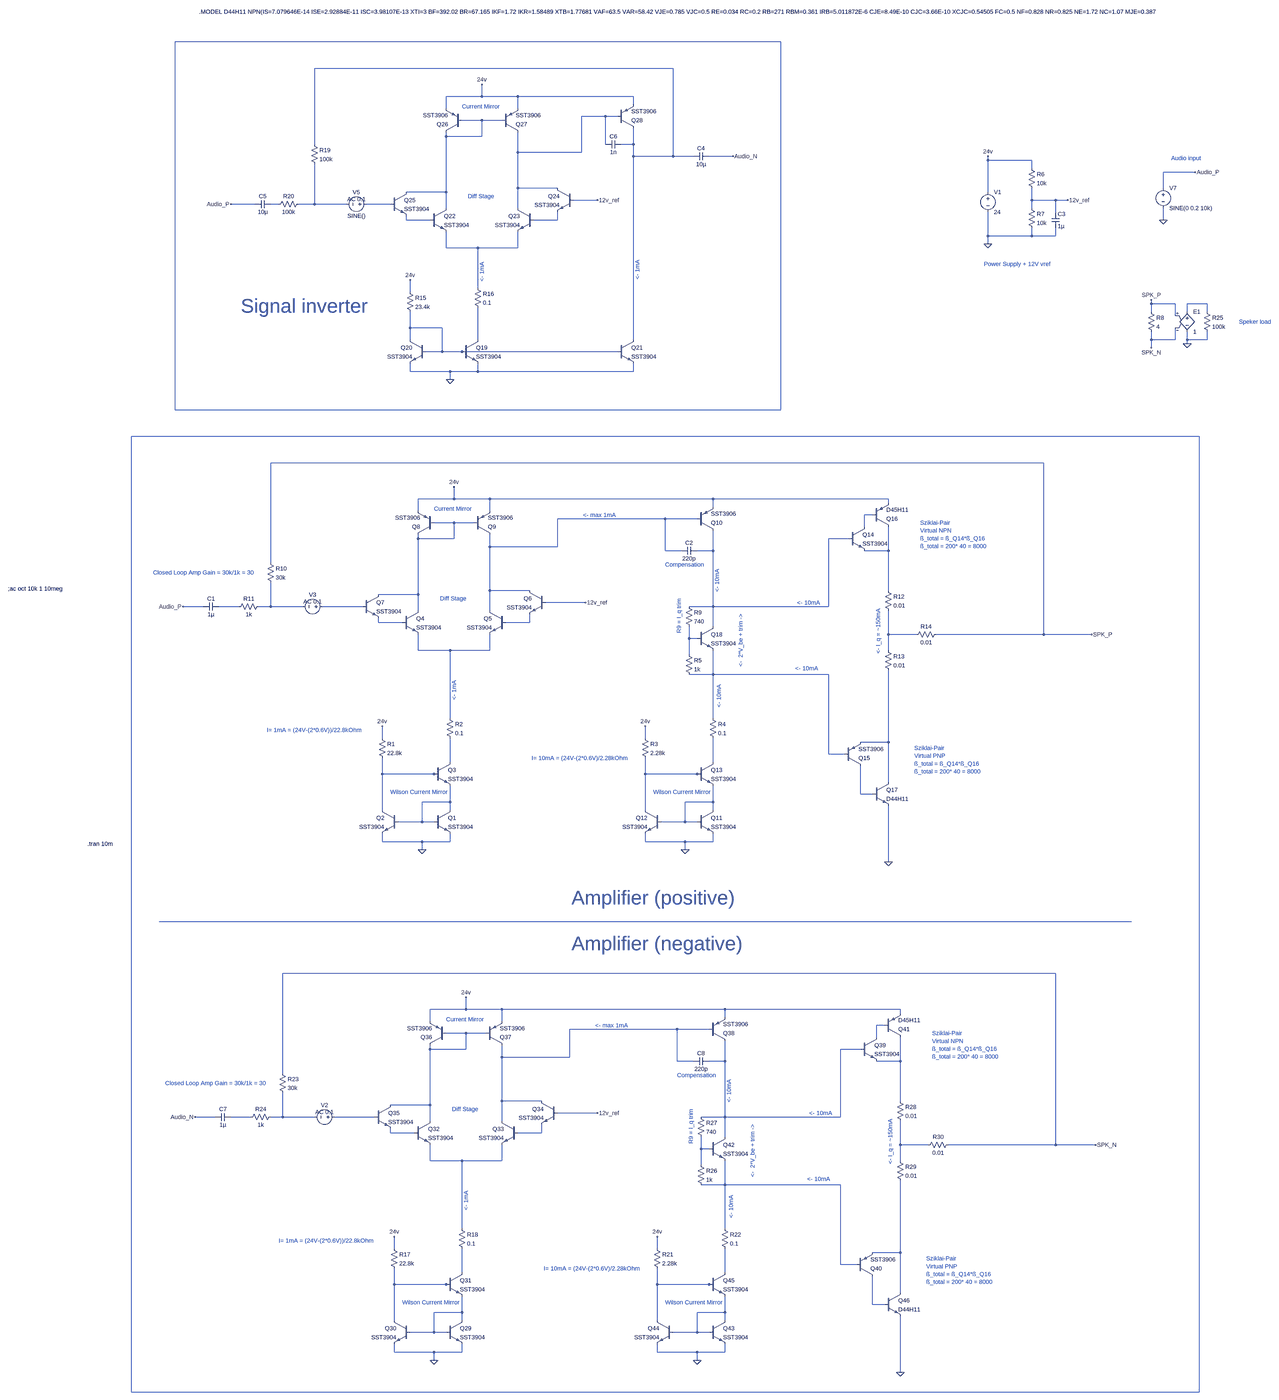
[diagram p0: schematic ClassAB.asc, whole sheet]
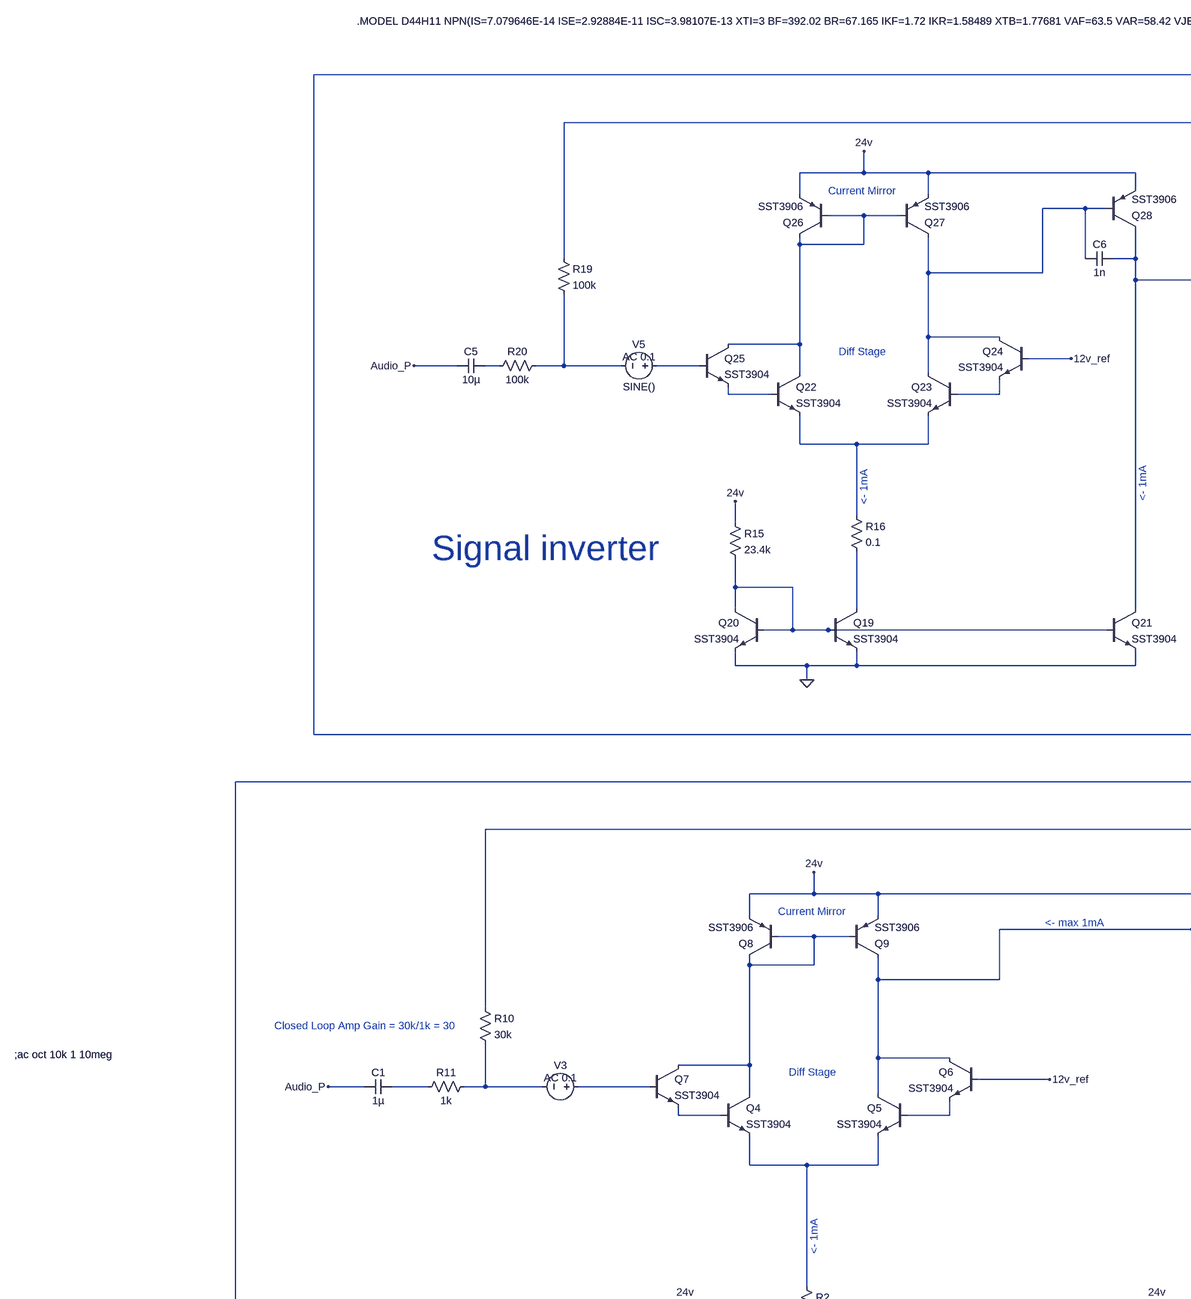
[diagram p1: schematic ClassAB.asc, part, row 1 of 2, column 1 of 2]
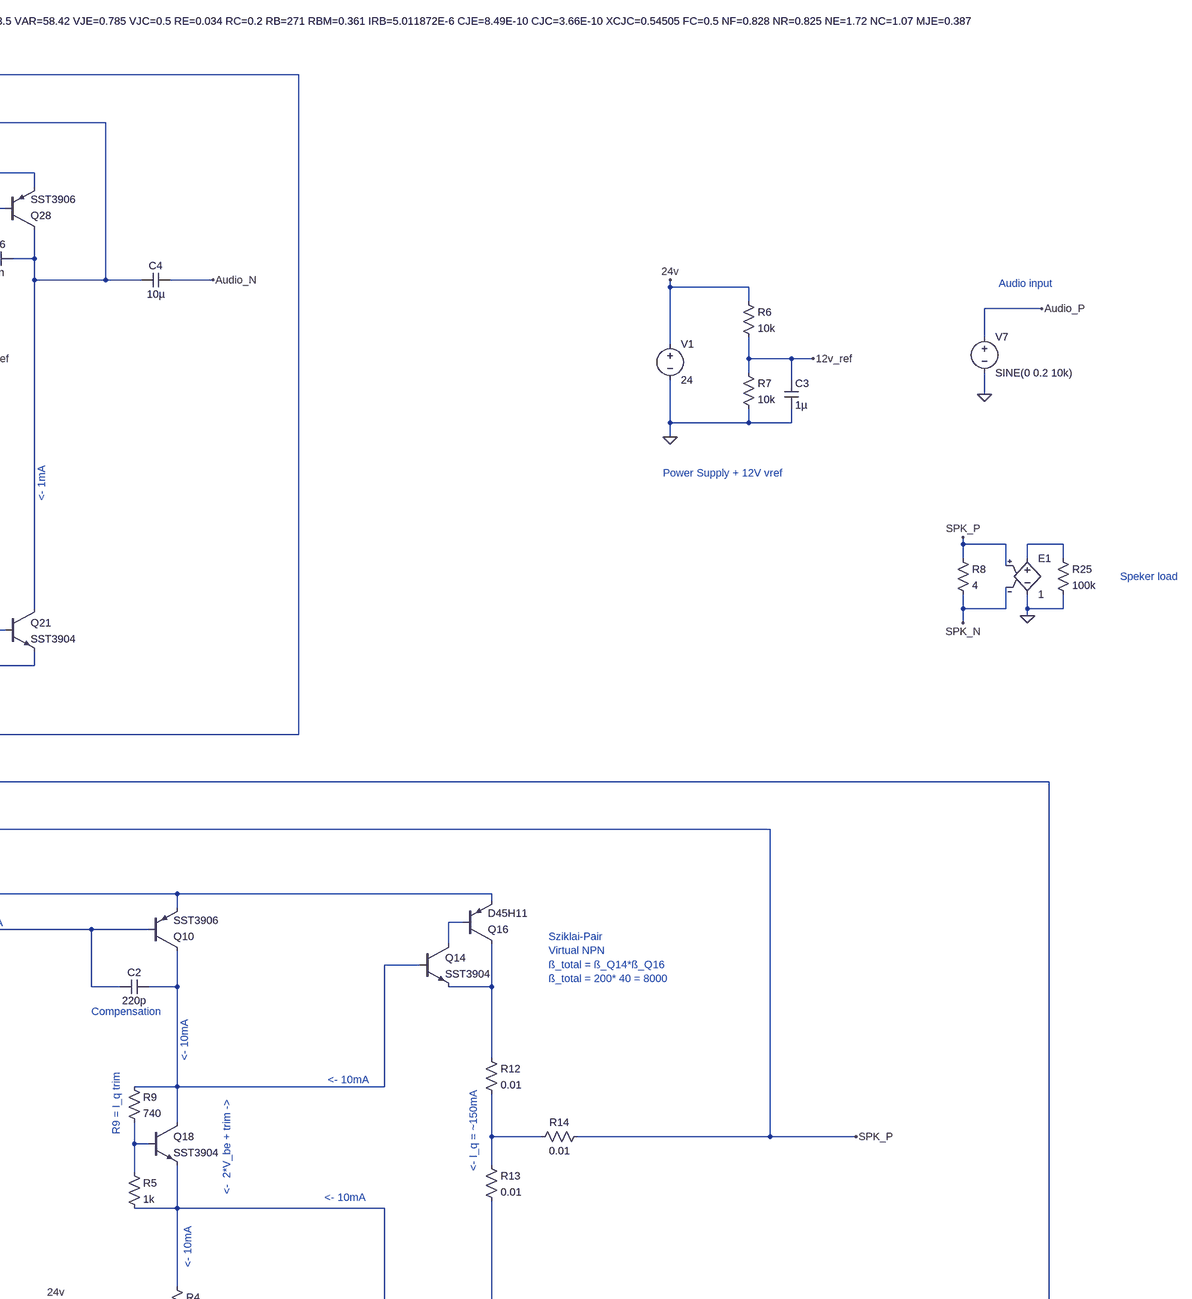
[diagram p2: schematic ClassAB.asc, part, row 1 of 2, column 2 of 2]
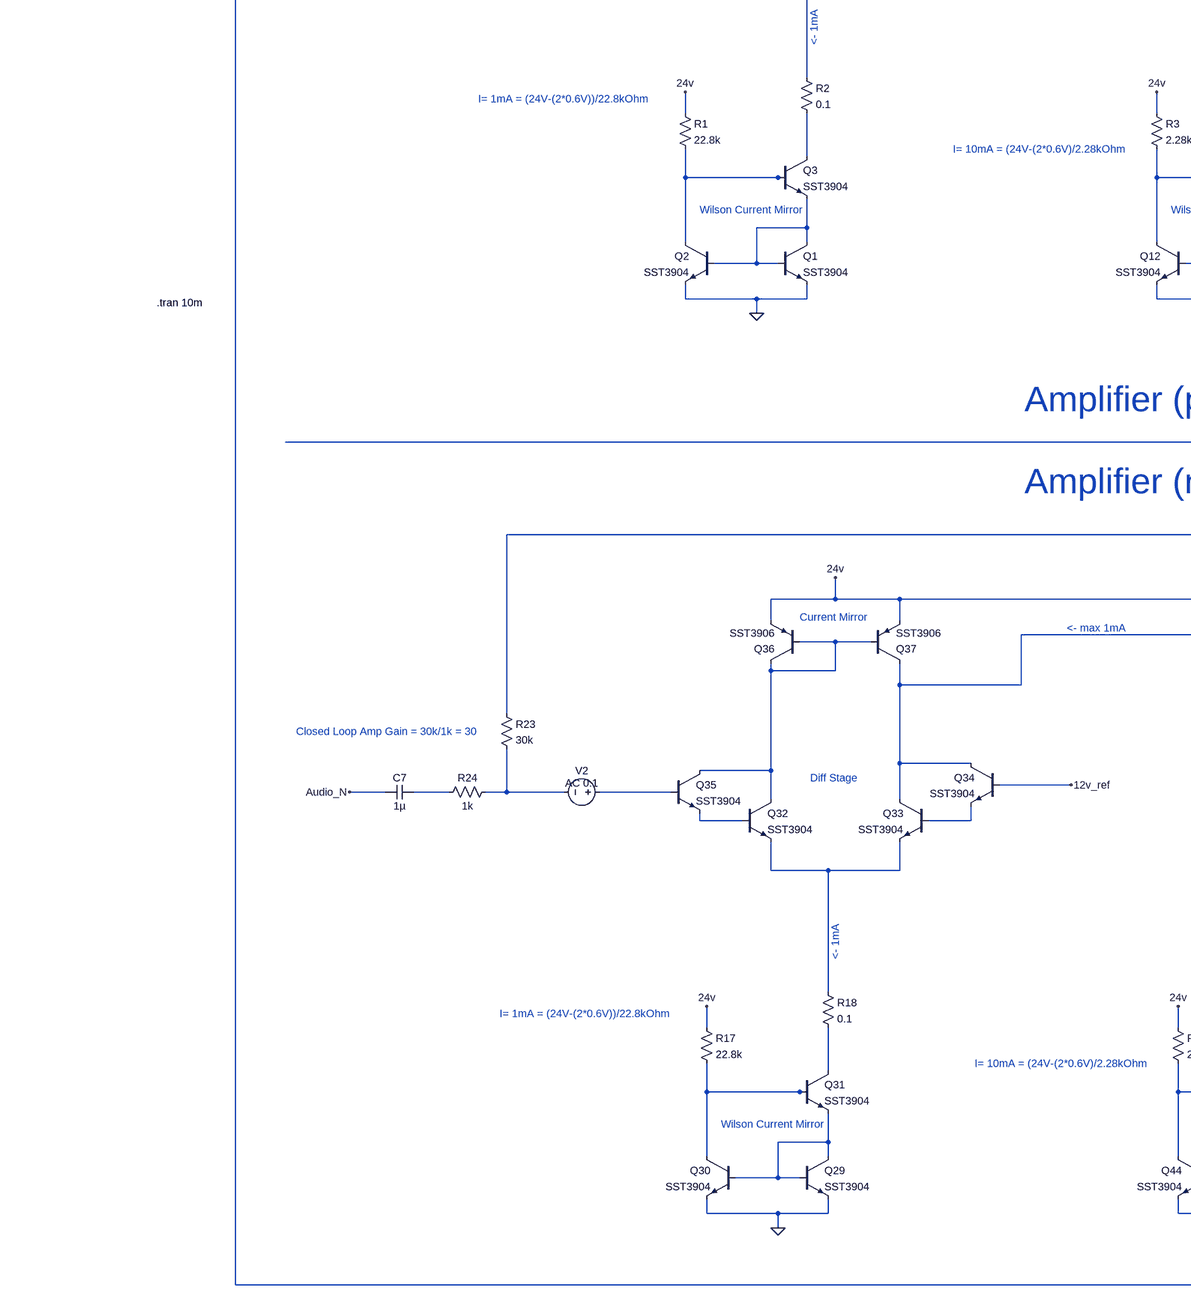
[diagram p3: schematic ClassAB.asc, part, row 2 of 2, column 1 of 2]
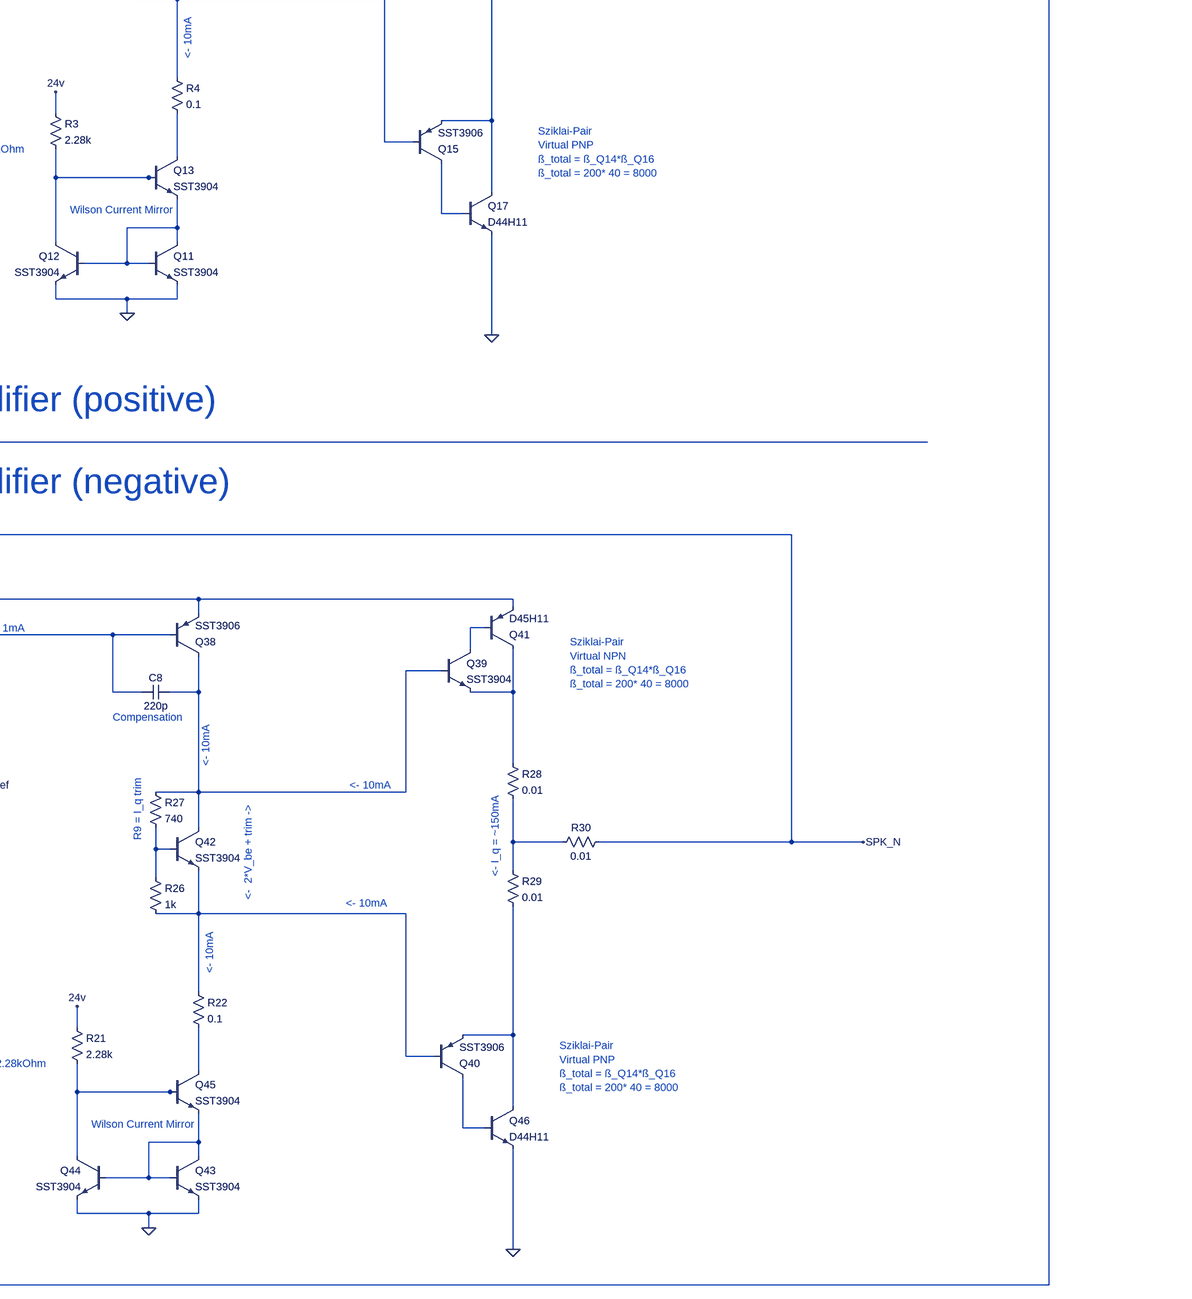
[diagram p4: schematic ClassAB.asc, part, row 2 of 2, column 2 of 2]
ClassAB.asc, the LTspice schematic file:
Version 4
SHEET 1 5220 3864
WIRE 2704 -3360 272 -3360
WIRE 2272 -3200 832 -3200
WIRE 1504 -3088 1504 -3136
WIRE 1504 -3088 1360 -3088
WIRE 1648 -3088 1504 -3088
WIRE 2112 -3088 1648 -3088
WIRE 2112 -3056 2112 -3088
WIRE 1360 -3040 1360 -3088
WIRE 1648 -3040 1648 -3088
WIRE 2000 -3008 1904 -3008
WIRE 2048 -3008 2000 -3008
WIRE 1504 -2992 1424 -2992
WIRE 1584 -2992 1504 -2992
WIRE 1360 -2928 1360 -2944
WIRE 1504 -2928 1504 -2992
WIRE 1504 -2928 1360 -2928
WIRE 832 -2896 832 -3200
WIRE 2000 -2896 2000 -3008
WIRE 2112 -2896 2112 -2960
WIRE 2112 -2896 2064 -2896
WIRE 1648 -2864 1648 -2944
WIRE 1904 -2864 1904 -3008
WIRE 1904 -2864 1648 -2864
WIRE 2112 -2848 2112 -2896
WIRE 2272 -2848 2272 -3200
WIRE 2272 -2848 2112 -2848
WIRE 2352 -2848 2272 -2848
WIRE 2512 -2848 2416 -2848
WIRE 3536 -2832 3536 -2848
WIRE 3712 -2832 3536 -2832
WIRE 3712 -2800 3712 -2832
WIRE 4368 -2784 4240 -2784
WIRE 1648 -2720 1648 -2864
WIRE 1808 -2720 1648 -2720
WIRE 4240 -2720 4240 -2784
WIRE 1360 -2704 1360 -2928
WIRE 1360 -2704 1200 -2704
WIRE 3536 -2704 3536 -2832
WIRE 1968 -2672 1872 -2672
WIRE 3712 -2672 3712 -2720
WIRE 3808 -2672 3712 -2672
WIRE 3856 -2672 3808 -2672
WIRE 592 -2656 496 -2656
WIRE 688 -2656 656 -2656
WIRE 832 -2656 832 -2816
WIRE 832 -2656 768 -2656
WIRE 960 -2656 832 -2656
WIRE 1136 -2656 1040 -2656
WIRE 1360 -2640 1360 -2704
WIRE 1648 -2640 1648 -2720
WIRE 3712 -2640 3712 -2672
WIRE 3808 -2624 3808 -2672
WIRE 1200 -2592 1200 -2608
WIRE 1296 -2592 1200 -2592
WIRE 1808 -2592 1808 -2624
WIRE 1808 -2592 1712 -2592
WIRE 4240 -2592 4240 -2640
WIRE 3536 -2528 3536 -2624
WIRE 3712 -2528 3712 -2560
WIRE 3712 -2528 3536 -2528
WIRE 3808 -2528 3808 -2560
WIRE 3808 -2528 3712 -2528
WIRE 3536 -2496 3536 -2528
WIRE 1360 -2480 1360 -2544
WIRE 1488 -2480 1360 -2480
WIRE 1648 -2480 1648 -2544
WIRE 1648 -2480 1488 -2480
WIRE 1488 -2320 1488 -2480
WIRE 1216 -2304 1216 -2352
WIRE 4192 -2256 4192 -2272
WIRE 4288 -2256 4192 -2256
WIRE 4416 -2256 4336 -2256
WIRE 4192 -2224 4192 -2256
WIRE 4336 -2224 4336 -2256
WIRE 4416 -2224 4416 -2256
WIRE 4288 -2208 4288 -2256
WIRE 1216 -2160 1216 -2224
WIRE 1344 -2160 1216 -2160
WIRE 1216 -2112 1216 -2160
WIRE 1488 -2112 1488 -2240
WIRE 2112 -2112 2112 -2848
WIRE 4192 -2112 4192 -2144
WIRE 4288 -2112 4288 -2160
WIRE 4288 -2112 4192 -2112
WIRE 4336 -2112 4336 -2144
WIRE 4416 -2112 4416 -2144
WIRE 4416 -2112 4336 -2112
WIRE 4336 -2096 4336 -2112
WIRE 4192 -2080 4192 -2112
WIRE 1344 -2064 1344 -2160
WIRE 1344 -2064 1280 -2064
WIRE 1424 -2064 1344 -2064
WIRE 2048 -2064 1424 -2064
WIRE 1216 -1984 1216 -2016
WIRE 1376 -1984 1216 -1984
WIRE 1488 -1984 1488 -2016
WIRE 1488 -1984 1376 -1984
WIRE 2112 -1984 2112 -2016
WIRE 2112 -1984 1488 -1984
WIRE 1376 -1952 1376 -1984
WIRE 272 -1776 272 -3360
WIRE 2704 -1776 2704 -3360
WIRE 2704 -1776 272 -1776
WIRE 4384 -1568 96 -1568
WIRE 3760 -1008 656 -1008
WIRE 1392 -864 1392 -912
WIRE 1392 -864 1248 -864
WIRE 1536 -864 1392 -864
WIRE 2432 -864 1536 -864
WIRE 3136 -864 2432 -864
WIRE 3136 -848 3136 -864
WIRE 2432 -832 2432 -864
WIRE 1248 -816 1248 -864
WIRE 1536 -816 1536 -864
WIRE 3072 -800 3040 -800
WIRE 2240 -784 1808 -784
WIRE 2368 -784 2240 -784
WIRE 1392 -768 1312 -768
WIRE 1472 -768 1392 -768
WIRE 3040 -752 3040 -800
WIRE 1248 -704 1248 -720
WIRE 1392 -704 1392 -768
WIRE 1392 -704 1248 -704
WIRE 2976 -704 2896 -704
WIRE 1536 -672 1536 -720
WIRE 1808 -672 1808 -784
WIRE 1808 -672 1536 -672
WIRE 2240 -656 2240 -784
WIRE 2304 -656 2240 -656
WIRE 2432 -656 2432 -736
WIRE 2432 -656 2368 -656
WIRE 3136 -656 3136 -752
WIRE 3136 -656 3040 -656
WIRE 656 -608 656 -1008
WIRE 1536 -496 1536 -672
WIRE 1696 -496 1536 -496
WIRE 3136 -496 3136 -656
WIRE 1248 -480 1248 -704
WIRE 1248 -480 1088 -480
WIRE 1920 -448 1760 -448
WIRE 384 -432 304 -432
WIRE 528 -432 448 -432
WIRE 656 -432 656 -528
WIRE 656 -432 608 -432
WIRE 784 -432 656 -432
WIRE 1024 -432 864 -432
WIRE 2432 -432 2432 -656
WIRE 2432 -432 2336 -432
WIRE 2896 -432 2896 -704
WIRE 2896 -432 2432 -432
WIRE 1248 -416 1248 -480
WIRE 1536 -416 1536 -496
WIRE 1088 -368 1088 -384
WIRE 1184 -368 1088 -368
WIRE 1696 -368 1696 -400
WIRE 1696 -368 1600 -368
WIRE 2432 -352 2432 -432
WIRE 3136 -320 3136 -416
WIRE 3248 -320 3136 -320
WIRE 3760 -320 3760 -1008
WIRE 3760 -320 3328 -320
WIRE 3952 -320 3760 -320
WIRE 2336 -304 2336 -352
WIRE 2368 -304 2336 -304
WIRE 1248 -256 1248 -320
WIRE 1376 -256 1248 -256
WIRE 1536 -256 1536 -320
WIRE 1536 -256 1376 -256
WIRE 3136 -256 3136 -320
WIRE 2336 -240 2336 -304
WIRE 2432 -160 2432 -256
WIRE 2432 -160 2336 -160
WIRE 2896 -160 2432 -160
WIRE 1376 16 1376 -256
WIRE 2432 16 2432 -160
WIRE 1104 96 1104 48
WIRE 2160 96 2160 48
WIRE 3136 112 3136 -176
WIRE 3136 112 3024 112
WIRE 2896 160 2896 -160
WIRE 2960 160 2896 160
WIRE 1376 192 1376 96
WIRE 2432 192 2432 96
WIRE 1104 240 1104 176
WIRE 1312 240 1104 240
WIRE 1328 240 1312 240
WIRE 2160 240 2160 176
WIRE 2368 240 2160 240
WIRE 2384 240 2368 240
WIRE 3136 272 3136 112
WIRE 3024 320 3024 208
WIRE 3072 320 3024 320
WIRE 1376 352 1376 288
WIRE 1376 352 1264 352
WIRE 2432 352 2432 288
WIRE 2432 352 2320 352
WIRE 1104 384 1104 240
WIRE 1376 384 1376 352
WIRE 2160 384 2160 240
WIRE 2432 384 2432 352
WIRE 1264 432 1264 352
WIRE 1264 432 1168 432
WIRE 1312 432 1264 432
WIRE 2320 432 2320 352
WIRE 2320 432 2224 432
WIRE 2368 432 2320 432
WIRE 1104 512 1104 480
WIRE 1264 512 1104 512
WIRE 1376 512 1376 480
WIRE 1376 512 1264 512
WIRE 2160 512 2160 480
WIRE 2320 512 2160 512
WIRE 2432 512 2432 480
WIRE 2432 512 2320 512
WIRE 1264 544 1264 512
WIRE 2320 544 2320 512
WIRE 3136 592 3136 368
WIRE 4112 832 208 832
WIRE 3808 1040 704 1040
WIRE 1440 1184 1440 1136
WIRE 1440 1184 1296 1184
WIRE 1584 1184 1440 1184
WIRE 2480 1184 1584 1184
WIRE 3184 1184 2480 1184
WIRE 3184 1200 3184 1184
WIRE 2480 1216 2480 1184
WIRE 1296 1232 1296 1184
WIRE 1584 1232 1584 1184
WIRE 3120 1248 3088 1248
WIRE 2288 1264 1856 1264
WIRE 2416 1264 2288 1264
WIRE 1440 1280 1360 1280
WIRE 1520 1280 1440 1280
WIRE 3088 1296 3088 1248
WIRE 1296 1344 1296 1328
WIRE 1440 1344 1440 1280
WIRE 1440 1344 1296 1344
WIRE 3024 1344 2944 1344
WIRE 1584 1376 1584 1328
WIRE 1856 1376 1856 1264
WIRE 1856 1376 1584 1376
WIRE 2288 1392 2288 1264
WIRE 2352 1392 2288 1392
WIRE 2480 1392 2480 1312
WIRE 2480 1392 2416 1392
WIRE 3184 1392 3184 1296
WIRE 3184 1392 3088 1392
WIRE 704 1440 704 1040
WIRE 1584 1552 1584 1376
WIRE 1744 1552 1584 1552
WIRE 3184 1552 3184 1392
WIRE 1296 1568 1296 1344
WIRE 1296 1568 1136 1568
WIRE 1968 1600 1808 1600
WIRE 432 1616 352 1616
WIRE 576 1616 496 1616
WIRE 704 1616 704 1520
WIRE 704 1616 656 1616
WIRE 832 1616 704 1616
WIRE 1072 1616 912 1616
WIRE 2480 1616 2480 1392
WIRE 2480 1616 2384 1616
WIRE 2944 1616 2944 1344
WIRE 2944 1616 2480 1616
WIRE 1296 1632 1296 1568
WIRE 1584 1632 1584 1552
WIRE 1136 1680 1136 1664
WIRE 1232 1680 1136 1680
WIRE 1744 1680 1744 1648
WIRE 1744 1680 1648 1680
WIRE 2480 1696 2480 1616
WIRE 3184 1728 3184 1632
WIRE 3296 1728 3184 1728
WIRE 3808 1728 3808 1040
WIRE 3808 1728 3376 1728
WIRE 3968 1728 3808 1728
WIRE 2384 1744 2384 1696
WIRE 2416 1744 2384 1744
WIRE 1296 1792 1296 1728
WIRE 1424 1792 1296 1792
WIRE 1584 1792 1584 1728
WIRE 1584 1792 1424 1792
WIRE 3184 1792 3184 1728
WIRE 2384 1808 2384 1744
WIRE 2480 1888 2480 1792
WIRE 2480 1888 2384 1888
WIRE 2944 1888 2480 1888
WIRE 1424 2064 1424 1792
WIRE 2480 2064 2480 1888
WIRE 1152 2144 1152 2096
WIRE 2208 2144 2208 2096
WIRE 3184 2160 3184 1872
WIRE 3184 2160 3072 2160
WIRE 2944 2208 2944 1888
WIRE 3008 2208 2944 2208
WIRE 1424 2240 1424 2144
WIRE 2480 2240 2480 2144
WIRE 1152 2288 1152 2224
WIRE 1360 2288 1152 2288
WIRE 1376 2288 1360 2288
WIRE 2208 2288 2208 2224
WIRE 2416 2288 2208 2288
WIRE 2432 2288 2416 2288
WIRE 3184 2320 3184 2160
WIRE 3072 2368 3072 2256
WIRE 3120 2368 3072 2368
WIRE 1424 2400 1424 2336
WIRE 1424 2400 1312 2400
WIRE 2480 2400 2480 2336
WIRE 2480 2400 2368 2400
WIRE 1152 2432 1152 2288
WIRE 1424 2432 1424 2400
WIRE 2208 2432 2208 2288
WIRE 2480 2432 2480 2400
WIRE 1312 2480 1312 2400
WIRE 1312 2480 1216 2480
WIRE 1360 2480 1312 2480
WIRE 2368 2480 2368 2400
WIRE 2368 2480 2272 2480
WIRE 2416 2480 2368 2480
WIRE 1152 2560 1152 2528
WIRE 1312 2560 1152 2560
WIRE 1424 2560 1424 2528
WIRE 1424 2560 1312 2560
WIRE 2208 2560 2208 2528
WIRE 2368 2560 2208 2560
WIRE 2480 2560 2480 2528
WIRE 2480 2560 2368 2560
WIRE 1312 2592 1312 2560
WIRE 2368 2592 2368 2560
WIRE 3184 2640 3184 2416
WIRE 96 2720 96 -1568
WIRE 4384 2720 4384 -1568
WIRE 4384 2720 96 2720
FLAG 1264 544 0
FLAG 1104 48 24v
FLAG 3536 -2848 24v
FLAG 1392 -912 24v
FLAG 3536 -2496 0
FLAG 2160 48 24v
FLAG 2320 544 0
FLAG 3136 592 0
FLAG 1376 -1952 0
FLAG 1216 -2352 24v
FLAG 1504 -3136 24v
FLAG 496 -2656 Audio_P
FLAG 3856 -2672 12v_ref
FLAG 1920 -448 12v_ref
FLAG 1968 -2672 12v_ref
FLAG 2512 -2848 Audio_N
FLAG 304 -432 Audio_P
FLAG 1312 2592 0
FLAG 1152 2096 24v
FLAG 1440 1136 24v
FLAG 2208 2096 24v
FLAG 2368 2592 0
FLAG 3184 2640 0
FLAG 1968 1600 12v_ref
FLAG 352 1616 Audio_N
FLAG 4240 -2592 0
FLAG 4368 -2784 Audio_P
FLAG 3968 1728 SPK_N
FLAG 3952 -320 SPK_P
FLAG 4192 -2272 SPK_P
FLAG 4192 -2080 SPK_N
FLAG 4336 -2096 0
SYMBOL voltage 3536 -2720 R0
WINDOW 123 0 0 Left 0
WINDOW 39 0 0 Left 0
SYMATTR InstName V1
SYMATTR Value 24
SYMBOL npn 1312 384 R0
SYMATTR InstName Q1
SYMATTR Value SST3904
SYMBOL npn 1168 384 M0
SYMATTR InstName Q2
SYMATTR Value SST3904
SYMBOL npn 1312 192 R0
SYMATTR InstName Q3
SYMATTR Value SST3904
SYMBOL res 1088 80 R0
SYMATTR InstName R1
SYMATTR Value 22.8k
SYMBOL npn 1184 -416 R0
SYMATTR InstName Q4
SYMATTR Value SST3904
SYMBOL npn 1600 -416 M0
SYMATTR InstName Q5
SYMATTR Value SST3904
SYMBOL npn 1760 -496 M0
SYMATTR InstName Q6
SYMATTR Value SST3904
SYMBOL npn 1024 -480 R0
SYMATTR InstName Q7
SYMATTR Value SST3904
SYMBOL res 1360 0 R0
SYMATTR InstName R2
SYMATTR Value 0.1
SYMBOL pnp 1312 -720 R180
SYMATTR InstName Q8
SYMATTR Value SST3906
SYMBOL pnp 1472 -720 M180
SYMATTR InstName Q9
SYMATTR Value SST3906
SYMBOL pnp 2368 -736 M180
SYMATTR InstName Q10
SYMATTR Value SST3906
SYMBOL res 2144 80 R0
SYMATTR InstName R3
SYMATTR Value 2.28k
SYMBOL res 2416 0 R0
SYMATTR InstName R4
SYMATTR Value 0.1
SYMBOL npn 2976 -752 R0
SYMATTR InstName Q14
SYMATTR Value SST3904
SYMBOL pnp 2960 208 M180
SYMATTR InstName Q15
SYMATTR Value SST3906
SYMBOL res 640 -624 R0
SYMATTR InstName R10
SYMATTR Value 30k
SYMBOL res 624 -448 R90
WINDOW 0 0 56 VBottom 2
WINDOW 3 32 56 VTop 2
SYMATTR InstName R11
SYMATTR Value 1k
SYMBOL cap 448 -448 R90
WINDOW 0 0 32 VBottom 2
WINDOW 3 32 32 VTop 2
SYMATTR InstName C1
SYMATTR Value 1µ
SYMBOL voltage 880 -432 R90
WINDOW 0 -32 56 VBottom 2
WINDOW 3 32 56 VTop 2
WINDOW 123 -4 56 VBottom 2
WINDOW 39 0 0 Left 0
SYMATTR InstName V3
SYMATTR Value ""
SYMATTR Value2 AC 0.1
SYMBOL pnp 3072 -752 M180
SYMATTR InstName Q16
SYMATTR Value D45H11
SYMBOL npn 2368 -352 R0
SYMATTR InstName Q18
SYMATTR Value SST3904
SYMBOL res 2320 -256 R0
SYMATTR InstName R5
SYMATTR Value 1k
SYMBOL res 2320 -448 R0
SYMATTR InstName R9
SYMATTR Value 740
SYMBOL res 3120 -512 R0
SYMATTR InstName R12
SYMATTR Value 0.01
SYMBOL res 3120 -272 R0
SYMATTR InstName R13
SYMATTR Value 0.01
SYMBOL cap 2368 -672 R90
WINDOW 0 0 32 VBottom 2
WINDOW 3 32 32 VTop 2
SYMATTR InstName C2
SYMATTR Value 220p
SYMBOL npn 2368 384 R0
SYMATTR InstName Q11
SYMATTR Value SST3904
SYMBOL npn 2224 384 M0
SYMATTR InstName Q12
SYMATTR Value SST3904
SYMBOL npn 2368 192 R0
SYMATTR InstName Q13
SYMATTR Value SST3904
SYMBOL res 3344 -336 R90
WINDOW 0 0 56 VBottom 2
WINDOW 3 32 56 VTop 2
SYMATTR InstName R14
SYMATTR Value 0.01
SYMBOL npn 3072 272 R0
SYMATTR InstName Q17
SYMATTR Value D44H11
SYMBOL npn 1424 -2112 R0
SYMATTR InstName Q19
SYMATTR Value SST3904
SYMBOL npn 1280 -2112 M0
SYMATTR InstName Q20
SYMATTR Value SST3904
SYMBOL res 1200 -2320 R0
SYMATTR InstName R15
SYMATTR Value 23.4k
SYMBOL npn 1296 -2640 R0
SYMATTR InstName Q22
SYMATTR Value SST3904
SYMBOL npn 1712 -2640 M0
SYMATTR InstName Q23
SYMATTR Value SST3904
SYMBOL npn 1872 -2720 M0
SYMATTR InstName Q24
SYMATTR Value SST3904
SYMBOL npn 1136 -2704 R0
SYMATTR InstName Q25
SYMATTR Value SST3904
SYMBOL res 1472 -2336 R0
SYMATTR InstName R16
SYMATTR Value 0.1
SYMBOL pnp 1424 -2944 R180
SYMATTR InstName Q26
SYMATTR Value SST3906
SYMBOL pnp 1584 -2944 M180
SYMATTR InstName Q27
SYMATTR Value SST3906
SYMBOL res 816 -2912 R0
SYMATTR InstName R19
SYMATTR Value 100k
SYMBOL res 784 -2672 R90
WINDOW 0 0 56 VBottom 2
WINDOW 3 32 56 VTop 2
SYMATTR InstName R20
SYMATTR Value 100k
SYMBOL cap 656 -2672 R90
WINDOW 0 0 32 VBottom 2
WINDOW 3 32 32 VTop 2
SYMATTR InstName C5
SYMATTR Value 10µ
SYMBOL pnp 2048 -2960 M180
SYMATTR InstName Q28
SYMATTR Value SST3906
SYMBOL cap 2064 -2912 R90
WINDOW 0 0 32 VBottom 2
WINDOW 3 32 32 VTop 2
SYMATTR InstName C6
SYMATTR Value 1n
SYMBOL npn 2048 -2112 R0
SYMATTR InstName Q21
SYMATTR Value SST3904
SYMBOL voltage 1056 -2656 R90
WINDOW 0 -32 56 VBottom 2
WINDOW 3 32 56 VTop 2
WINDOW 123 -4 56 VBottom 2
WINDOW 39 0 0 Left 0
SYMATTR InstName V5
SYMATTR Value SINE()
SYMATTR Value2 AC 0.1
SYMBOL res 3696 -2816 R0
SYMATTR InstName R6
SYMATTR Value 10k
SYMBOL res 3696 -2656 R0
SYMATTR InstName R7
SYMATTR Value 10k
SYMBOL cap 3792 -2624 R0
SYMATTR InstName C3
SYMATTR Value 1µ
SYMBOL cap 2416 -2864 R90
WINDOW 0 0 32 VBottom 2
WINDOW 3 32 32 VTop 2
SYMATTR InstName C4
SYMATTR Value 10µ
SYMBOL npn 1360 2432 R0
SYMATTR InstName Q29
SYMATTR Value SST3904
SYMBOL npn 1216 2432 M0
SYMATTR InstName Q30
SYMATTR Value SST3904
SYMBOL npn 1360 2240 R0
SYMATTR InstName Q31
SYMATTR Value SST3904
SYMBOL res 1136 2128 R0
SYMATTR InstName R17
SYMATTR Value 22.8k
SYMBOL npn 1232 1632 R0
SYMATTR InstName Q32
SYMATTR Value SST3904
SYMBOL npn 1648 1632 M0
SYMATTR InstName Q33
SYMATTR Value SST3904
SYMBOL npn 1808 1552 M0
SYMATTR InstName Q34
SYMATTR Value SST3904
SYMBOL npn 1072 1568 R0
SYMATTR InstName Q35
SYMATTR Value SST3904
SYMBOL res 1408 2048 R0
SYMATTR InstName R18
SYMATTR Value 0.1
SYMBOL pnp 1360 1328 R180
SYMATTR InstName Q36
SYMATTR Value SST3906
SYMBOL pnp 1520 1328 M180
SYMATTR InstName Q37
SYMATTR Value SST3906
SYMBOL pnp 2416 1312 M180
SYMATTR InstName Q38
SYMATTR Value SST3906
SYMBOL res 2192 2128 R0
SYMATTR InstName R21
SYMATTR Value 2.28k
SYMBOL res 2464 2048 R0
SYMATTR InstName R22
SYMATTR Value 0.1
SYMBOL npn 3024 1296 R0
SYMATTR InstName Q39
SYMATTR Value SST3904
SYMBOL pnp 3008 2256 M180
SYMATTR InstName Q40
SYMATTR Value SST3906
SYMBOL res 688 1424 R0
SYMATTR InstName R23
SYMATTR Value 30k
SYMBOL res 672 1600 R90
WINDOW 0 0 56 VBottom 2
WINDOW 3 32 56 VTop 2
SYMATTR InstName R24
SYMATTR Value 1k
SYMBOL cap 496 1600 R90
WINDOW 0 0 32 VBottom 2
WINDOW 3 32 32 VTop 2
SYMATTR InstName C7
SYMATTR Value 1µ
SYMBOL voltage 928 1616 R90
WINDOW 0 -32 56 VBottom 2
WINDOW 3 32 56 VTop 2
WINDOW 123 -4 56 VBottom 2
WINDOW 39 0 0 Left 0
SYMATTR InstName V2
SYMATTR Value ""
SYMATTR Value2 AC 0.1
SYMBOL pnp 3120 1296 M180
SYMATTR InstName Q41
SYMATTR Value D45H11
SYMBOL npn 2416 1696 R0
SYMATTR InstName Q42
SYMATTR Value SST3904
SYMBOL res 2368 1792 R0
SYMATTR InstName R26
SYMATTR Value 1k
SYMBOL res 2368 1600 R0
SYMATTR InstName R27
SYMATTR Value 740
SYMBOL res 3168 1536 R0
SYMATTR InstName R28
SYMATTR Value 0.01
SYMBOL res 3168 1776 R0
SYMATTR InstName R29
SYMATTR Value 0.01
SYMBOL cap 2416 1376 R90
WINDOW 0 0 32 VBottom 2
WINDOW 3 32 32 VTop 2
SYMATTR InstName C8
SYMATTR Value 220p
SYMBOL npn 2416 2432 R0
SYMATTR InstName Q43
SYMATTR Value SST3904
SYMBOL npn 2272 2432 M0
SYMATTR InstName Q44
SYMATTR Value SST3904
SYMBOL npn 2416 2240 R0
SYMATTR InstName Q45
SYMATTR Value SST3904
SYMBOL res 3392 1712 R90
WINDOW 0 0 56 VBottom 2
WINDOW 3 32 56 VTop 2
SYMATTR InstName R30
SYMATTR Value 0.01
SYMBOL npn 3120 2320 R0
SYMATTR InstName Q46
SYMATTR Value D44H11
SYMBOL voltage 4240 -2736 R0
WINDOW 123 0 0 Left 0
WINDOW 39 0 0 Left 0
SYMATTR InstName V7
SYMATTR Value SINE(0 0.2 10k)
SYMBOL res 4176 -2240 R0
SYMATTR InstName R8
SYMATTR Value 4
SYMBOL e 4336 -2240 R0
SYMATTR InstName E1
SYMATTR Value 1
SYMBOL res 4400 -2240 R0
SYMATTR InstName R25
SYMATTR Value 100k
TEXT -80 520 Left 2 !.tran 10m
TEXT 1136 312 Left 2 ;Wilson Current Mirror
TEXT 640 64 Left 2 ;I= 1mA = (24V-(2*0.6V))/22.8kOhm
TEXT 1704 176 Left 2 ;I= 10mA = (24V-(2*0.6V)/2.28kOhm
TEXT -520 -504 Left 2 !;ac oct 10k 1 10meg
TEXT 2192 312 Left 2 ;Wilson Current Mirror
TEXT 2296 -464 VRight 2 ;R9 = I_q trim
TEXT 2240 -600 Left 2 ;Compensation
TEXT 1408 -96 VBottom 2 ;<- 1mA
TEXT 1976 -784 Bottom 2 ;<- max 1mA
TEXT 2472 -72 VBottom 2 ;<- 10mA
TEXT 2808 -168 Bottom 2 ;<- 10mA
TEXT 2816 -432 Bottom 2 ;<- 10mA
TEXT 2528 -296 VTop 2 ;<-  2*V_be + trim ->
TEXT 3264 -768 Left 2 ;Sziklai-Pair\nVirtual NPN\nß_total = ß_Q14*ß_Q16\nß_total = 200* 40 = 8000
TEXT 3240 136 Left 2 ;Sziklai-Pair\nVirtual PNP\nß_total = ß_Q14*ß_Q16\nß_total = 200* 40 = 8000
TEXT 368 -5776 Left 2 !.MODEL D44H11 NPN(IS=7.079646E-14 ISE=2.92884E-11 ISC=3.98107E-13 XTI=3 BF=392.02 BR=67.165 IKF=1.72 IKR=1.58489 XTB=1.77681 VAF=63.5 VAR=58.42 VJE=0.785 VJC=0.5 RE=0.034 RC=0.2 RB=271 RBM=0.361 IRB=5.011872E-6 CJE=8.49E-10 CJC=3.66E-10 XCJC=0.54505 FC=0.5 NF=0.828 NR=0.825 NE=1.72 NC=1.07 MJE=0.387 MJC=0.352 EG=0.958 VCEO=80 ICRATING=10 MFG=FAIRCHILD)
TEXT 3096 -424 VRight 2 ;<- I_q = ~150mA
TEXT 1312 -824 Left 2 ;Current Mirror
TEXT 1336 -464 Left 2 ;Diff Stage
TEXT 2464 -536 VBottom 2 ;<- 10mA
TEXT 184 -568 Left 2 ;Closed Loop Amp Gain = 30k/1k = 30
TEXT 1520 -2384 VBottom 2 ;<- 1mA
TEXT 1424 -3048 Left 2 ;Current Mirror
TEXT 1448 -2688 Left 2 ;Diff Stage
TEXT 1184 2360 Left 2 ;Wilson Current Mirror
TEXT 688 2112 Left 2 ;I= 1mA = (24V-(2*0.6V))/22.8kOhm
TEXT 1752 2224 Left 2 ;I= 10mA = (24V-(2*0.6V)/2.28kOhm
TEXT 2240 2360 Left 2 ;Wilson Current Mirror
TEXT 2344 1584 VRight 2 ;R9 = I_q trim
TEXT 2288 1448 Left 2 ;Compensation
TEXT 1456 1952 VBottom 2 ;<- 1mA
TEXT 2024 1264 Bottom 2 ;<- max 1mA
TEXT 2520 1976 VBottom 2 ;<- 10mA
TEXT 2856 1880 Bottom 2 ;<- 10mA
TEXT 2864 1616 Bottom 2 ;<- 10mA
TEXT 2576 1752 VTop 2 ;<-  2*V_be + trim ->
TEXT 3312 1280 Left 2 ;Sziklai-Pair\nVirtual NPN\nß_total = ß_Q14*ß_Q16\nß_total = 200* 40 = 8000
TEXT 3288 2184 Left 2 ;Sziklai-Pair\nVirtual PNP\nß_total = ß_Q14*ß_Q16\nß_total = 200* 40 = 8000
TEXT 3144 1624 VRight 2 ;<- I_q = ~150mA
TEXT 1360 1224 Left 2 ;Current Mirror
TEXT 1384 1584 Left 2 ;Diff Stage
TEXT 2512 1512 VBottom 2 ;<- 10mA
TEXT 232 1480 Left 2 ;Closed Loop Amp Gain = 30k/1k = 30
TEXT 2144 -2392 VBottom 2 ;<- 1mA
TEXT 1864 736 Left 6 ;Amplifier (positive)
TEXT 1864 920 Left 6 ;Amplifier (negative)
TEXT 536 -2248 Left 6 ;Signal inverter
TEXT 3520 -2416 Left 2 ;Power Supply + 12V vref
TEXT 4272 -2840 Left 2 ;Audio input
TEXT 4544 -2184 Left 2 ;Speker load

The netlist it stands for:
* ClassAB.asc
V1 24v 0 24
Q1 N035 N035 0 0 SST3904
Q2 N032 N035 0 0 SST3904
Q3 N030 N032 N035 0 SST3904
R1 24v N032 22.8k
Q4 N017 N023 N027 0 SST3904
Q5 N016 N024 N027 0 SST3904
Q6 N016 12v_ref N024 0 SST3904
Q7 N017 N022 N023 0 SST3904
R2 N027 N030 0.1
Q8 N017 N017 24v 0 SST3906
Q9 N016 N017 24v 0 SST3906
Q10 N018 N016 24v 0 SST3906
R3 24v N033 2.28k
R4 N028 N031 0.1
Q14 N015 N018 N019 0 SST3904
Q15 N034 N028 N029 0 SST3906
R10 SPK_P N021 30k
R11 N021 N020 1k
C1 N020 Audio_P 1µ
V3 N022 N021 AC 0.1
Q16 N019 N015 24v 0 D45H11
Q18 N018 N026 N028 0 SST3904
R5 N026 N028 1k
R9 N018 N026 740
R12 N019 N025 0.01
R13 N025 N029 0.01
C2 N018 N016 220p
Q11 N036 N036 0 0 SST3904
Q12 N033 N036 0 0 SST3904
Q13 N031 N033 N036 0 SST3904
R14 SPK_P N025 0.01
Q17 N029 N034 0 0 D44H11
Q19 N013 N012 0 0 SST3904
Q20 N012 N012 0 0 SST3904
R15 24v N012 23.4k
Q22 N004 N008 N010 0 SST3904
Q23 N003 N009 N010 0 SST3904
Q24 N003 12v_ref N009 0 SST3904
Q25 N004 N007 N008 0 SST3904
R16 N010 N013 0.1
Q26 N004 N004 24v 0 SST3906
Q27 N003 N004 24v 0 SST3906
R19 N002 N006 100k
R20 N006 N005 100k
C5 N005 Audio_P 10µ
Q28 N002 N003 24v 0 SST3906
C6 N002 N003 1n
Q21 N002 N012 0 0 SST3904
V5 N007 N006 SINE() AC 0.1
R6 24v 12v_ref 10k
R7 12v_ref 0 10k
C3 12v_ref 0 1µ
C4 Audio_N N002 10µ
Q29 N058 N058 0 0 SST3904
Q30 N055 N058 0 0 SST3904
Q31 N053 N055 N058 0 SST3904
R17 24v N055 22.8k
Q32 N040 N046 N050 0 SST3904
Q33 N039 N047 N050 0 SST3904
Q34 N039 12v_ref N047 0 SST3904
Q35 N040 N045 N046 0 SST3904
R18 N050 N053 0.1
Q36 N040 N040 24v 0 SST3906
Q37 N039 N040 24v 0 SST3906
Q38 N041 N039 24v 0 SST3906
R21 24v N056 2.28k
R22 N051 N054 0.1
Q39 N038 N041 N042 0 SST3904
Q40 N057 N051 N052 0 SST3906
R23 SPK_N N044 30k
R24 N044 N043 1k
C7 N043 Audio_N 1µ
V2 N045 N044 AC 0.1
Q41 N042 N038 24v 0 D45H11
Q42 N041 N049 N051 0 SST3904
R26 N049 N051 1k
R27 N041 N049 740
R28 N042 N048 0.01
R29 N048 N052 0.01
C8 N041 N039 220p
Q43 N059 N059 0 0 SST3904
Q44 N056 N059 0 0 SST3904
Q45 N054 N056 N059 0 SST3904
R30 SPK_N N048 0.01
Q46 N052 N057 0 0 D44H11
V7 Audio_P 0 SINE(0 0.2 10k)
R8 SPK_P SPK_N 4
E1 N011 0 SPK_P SPK_N 1
R25 N011 0 100k
.model NPN NPN
.model PNP PNP
.lib standard.bjt
.tran 10m
* Wilson Current Mirror
* I= 1mA = (24V-(2*0.6V))/22.8kOhm
* I= 10mA = (24V-(2*0.6V)/2.28kOhm
;ac oct 10k 1 10meg
* Wilson Current Mirror
* R9 = I_q trim
* Compensation
* <- 1mA
* <- max 1mA
* <- 10mA
* <- 10mA
* <- 10mA
* <-  2*V_be + trim ->
* Sziklai-Pair
* Virtual NPN
* ß_total = ß_Q14*ß_Q16
* ß_total = 200* 40 = 8000
* Sziklai-Pair
* Virtual PNP
* ß_total = ß_Q14*ß_Q16
* ß_total = 200* 40 = 8000
.MODEL D44H11 NPN(IS=7.079646E-14 ISE=2.92884E-11 ISC=3.98107E-13 XTI=3 BF=392.02 BR=67.165 IKF=1.72 IKR=1.58489 XTB=1.77681 VAF=63.5 VAR=58.42 VJE=0.785 VJC=0.5 RE=0.034 RC=0.2 RB=271 RBM=0.361 IRB=5.011872E-6 CJE=8.49E-10 CJC=3.66E-10 XCJC=0.54505 FC=0.5 NF=0.828 NR=0.825 NE=1.72 NC=1.07 MJE=0.387 MJC=0.352 EG=0.958 VCEO=80 ICRATING=10 MFG=FAIRCHILD)
* <- I_q = ~150mA
* Current Mirror
* Diff Stage
* <- 10mA
* Closed Loop Amp Gain = 30k/1k = 30
* <- 1mA
* Current Mirror
* Diff Stage
* Wilson Current Mirror
* I= 1mA = (24V-(2*0.6V))/22.8kOhm
* I= 10mA = (24V-(2*0.6V)/2.28kOhm
* Wilson Current Mirror
* R9 = I_q trim
* Compensation
* <- 1mA
* <- max 1mA
* <- 10mA
* <- 10mA
* <- 10mA
* <-  2*V_be + trim ->
* Sziklai-Pair
* Virtual NPN
* ß_total = ß_Q14*ß_Q16
* ß_total = 200* 40 = 8000
* Sziklai-Pair
* Virtual PNP
* ß_total = ß_Q14*ß_Q16
* ß_total = 200* 40 = 8000
* <- I_q = ~150mA
* Current Mirror
* Diff Stage
* <- 10mA
* Closed Loop Amp Gain = 30k/1k = 30
* <- 1mA
* Amplifier (positive)
* Amplifier (negative)
* Signal inverter
* Power Supply + 12V vref
* Audio input
* Speker load
.backanno
.end